# EAGLE design MouserSTEAMySummer (EAGLE 9.1.1)
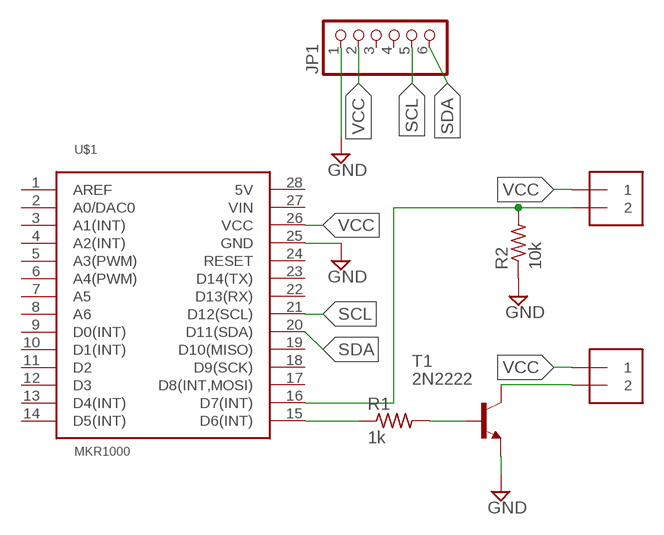
[diagram p0: schematic, sheet 1]

## Parts
BUZZER  1X2-3.5MM  [1X2-3.5MM]
J1  1X2-3.5MM  [1X2-3.5MM]
JP1  PINHD-1X6B  [1X06-BIG]
R1  1k  R-US_0207/7  [0207/7]
R2  10k  R-US_0207/7  [0207/7]
T1  2N2222  [TO92-EBC-OVAL]
U$1  MKR1000  [MKR1000-SOCKET]

## Nets
GND: JP1.1 R2.1 T1.E U$1.25(GND)
N$1: R1.1 U$1.15(D6(INT))
N$2: R1.2 T1.B
N$4: BUZZER.2 T1.C
N$5: J1.2 R2.2 U$1.16(D7(INT))
SCL: JP1.5 U$1.21(D12(SCL))
SDA: JP1.6 U$1.20(D11(SDA))
VCC: BUZZER.1 J1.1 JP1.2 U$1.26(VCC)
Unconnected: JP1.3 JP1.4 U$1.1(AREF) U$1.2(A0/DAC0) U$1.3(A1(INT)) U$1.4(A2(INT)) U$1.5(A3(PWM)) U$1.6(A4(PWM)) U$1.7(A5) U$1.8(A6) U$1.9(D0(INT)) U$1.10(D1(INT)) U$1.11(D2) U$1.12(D3) U$1.13(D4(INT)) U$1.14(D5(INT)) U$1.17(D8(INT,MOSI)) U$1.18(D9(SCK)) U$1.19(D10(MISO)) U$1.22(D13(RX)) U$1.23(D14(TX)) U$1.24(RESET) U$1.27(VIN) U$1.28(5V)

## Library data of the parts
BUZZER J1 = adafruit:1X2: 3.5mm Terminal block http://www.ladyada.net/library/pcb/eaglelibrary.html
JP1 = adafruit:PINHD-1X6: PIN HEADER
R1 R2 = adafruit:R-US_: RESISTOR, American symbol
T1 = adafruit:2N2222: NPN TRANSISTOR Big oval pads
U$1 = IAD-Library:MKR1000: The Arduino MKR1000.

## Board
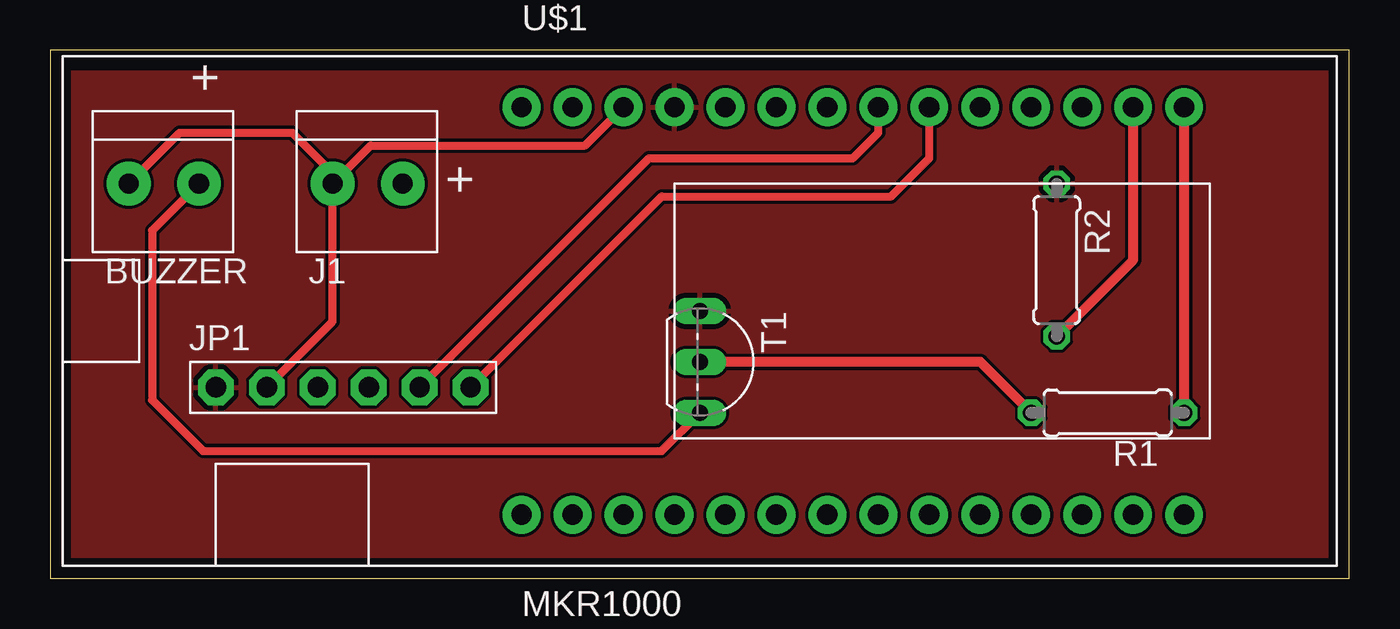
[diagram p1: board, top side]
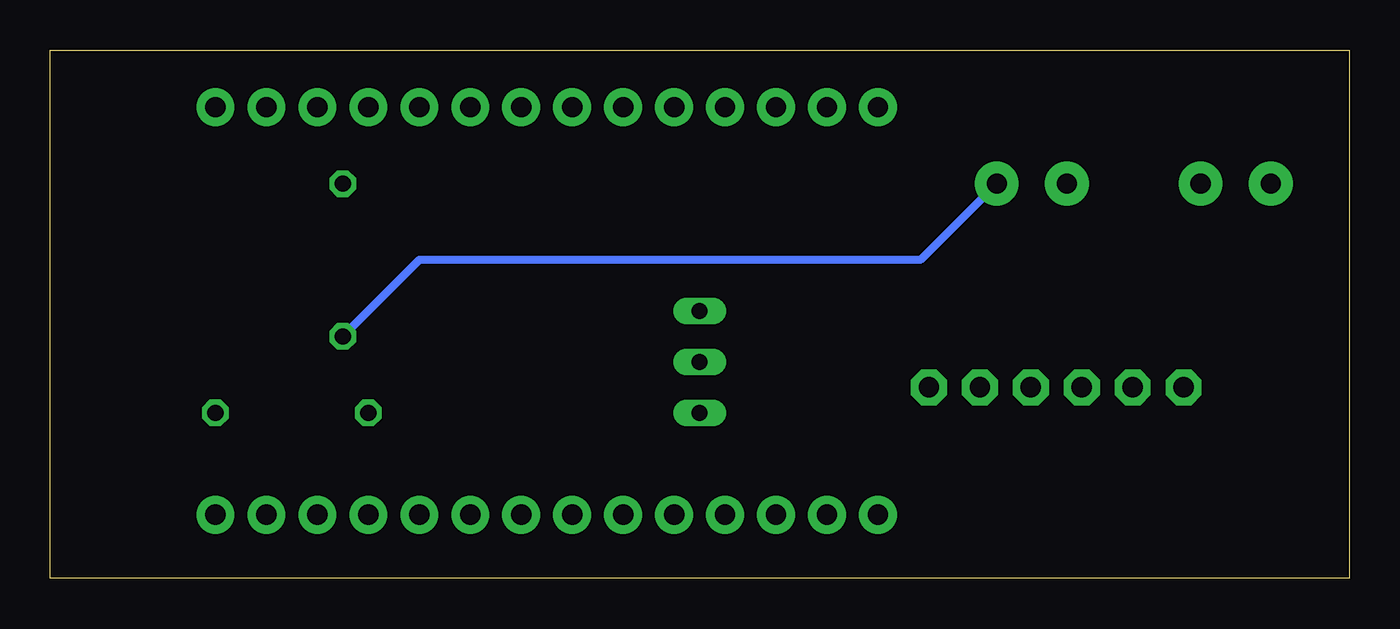
[diagram p2: board, bottom side, seen from below]

Size 64.75 x 26.34 mm. Coordinates in mm from the lower left corner, seen from the top.
Outline: 0,0 64.75,0 64.75,26.34 0,26.34 0,0
Copper layers (1*16): Top 0.035mm / dielectric 1.5mm / Bottom 0.035mm
Design rules "default": minimum track width 6mil, minimum drill 0.35mm, track to track 6mil, track to pad 6mil, pad to pad 6mil, via to via 6mil, smd to smd 6mil, copper to edge 40mil, drill to drill 6mil, minimum pad ring 10mil, minimum via ring 8mil, stop-mask expansion 4mil, vias tented up to drill 0mil, thermal gap 10mil

### Footprints (pad centres in the part's own frame; a part is rotated, then mirrored left to right if it is on the bottom)
1X2-3.5MM = drill 1 pad 2.184: 1 1.8,0; 2 -1.7,0
1X06-BIG = drill 1.016 pad 1.778 octagon: 1 -6.35,0; 2 -3.81,0; 3 -1.27,0; 4 1.27,0; 5 3.81,0; 6 6.35,0
0207/7 = drill 0.813 octagon: 1 -3.81,0; 2 3.81,0
TO92-EBC-OVAL = drill 0.813 long: B 0,-1.27; C 2.54,-1.27; E -2.54,-1.27
MKR1000-SOCKET = drill 1.016 pad 1.88: 1 -16.51,-10.16; 2 -13.97,-10.16; 3 -11.43,-10.16; 4 -8.89,-10.16; 5 -6.35,-10.16; 6 -3.81,-10.16; 7 -1.27,-10.16; 8 1.27,-10.16; 9 3.81,-10.16; 10 6.35,-10.16; 11 8.89,-10.16; 12 11.43,-10.16; 13 13.97,-10.16; 14 16.51,-10.16; 15 16.51,10.16; 16 13.97,10.16; 17 11.43,10.16; 18 8.89,10.16; 19 6.35,10.16; 20 3.81,10.16; 21 1.27,10.16; 22 -1.27,10.16; 23 -3.81,10.16; 24 -6.35,10.16; 25 -8.89,10.16; 26 -11.43,10.16; 27 -13.97,10.16; 28 -16.51,10.16

### Placement (x,y rotation side)
BUZZER  5.72,19.69 180 top
J1  15.88,19.69 180 top
JP1  14.61,9.52 0 top
R1  52.7,8.26 180 top
R2  50.17,15.88 270 top
T1  33.66,10.8 270 top
U$1  40,13.34 0 top

### Tracks (layer width: path | path; a pad name or v marks a point on that pad's centre or on a via)
GND
  pour Top: 0,26.67 0,0 64.77,0 64.77,26.67
N$1
  Top 0.508: R1.1 U$1.15
N$2
  Top 0.508: R1.2 46.36,10.8 T1.B
N$4
  Top 0.406: BUZZER.2 5.08,17.35 5.08,8.89 7.62,6.35 30.48,6.35 T1.C
N$5
  Top 0.508: R2.2 53.98,15.88 U$1.16
  Bottom 0.406: J1.2 21.39,15.88 46.36,15.88 R2.2
SCL
  Top 0.406: JP1.5 29.84,20.95 40,20.95 41.28,22.23 U$1.21
SDA
  Top 0.406: JP1.6 30.48,19.05 41.91,19.05 43.81,20.95 U$1.20
VCC
  Top 0.406: BUZZER.1 6.45,22.23 12.06,22.23 14.08,20.22 J1.1 | JP1.2 14.08,12.8 J1.1 | J1.1 15.98,21.59 26.67,21.59 U$1.26

### Text on the board
tPlace: + | +